# EAGLE design Garage_PCB (EAGLE 6.4)
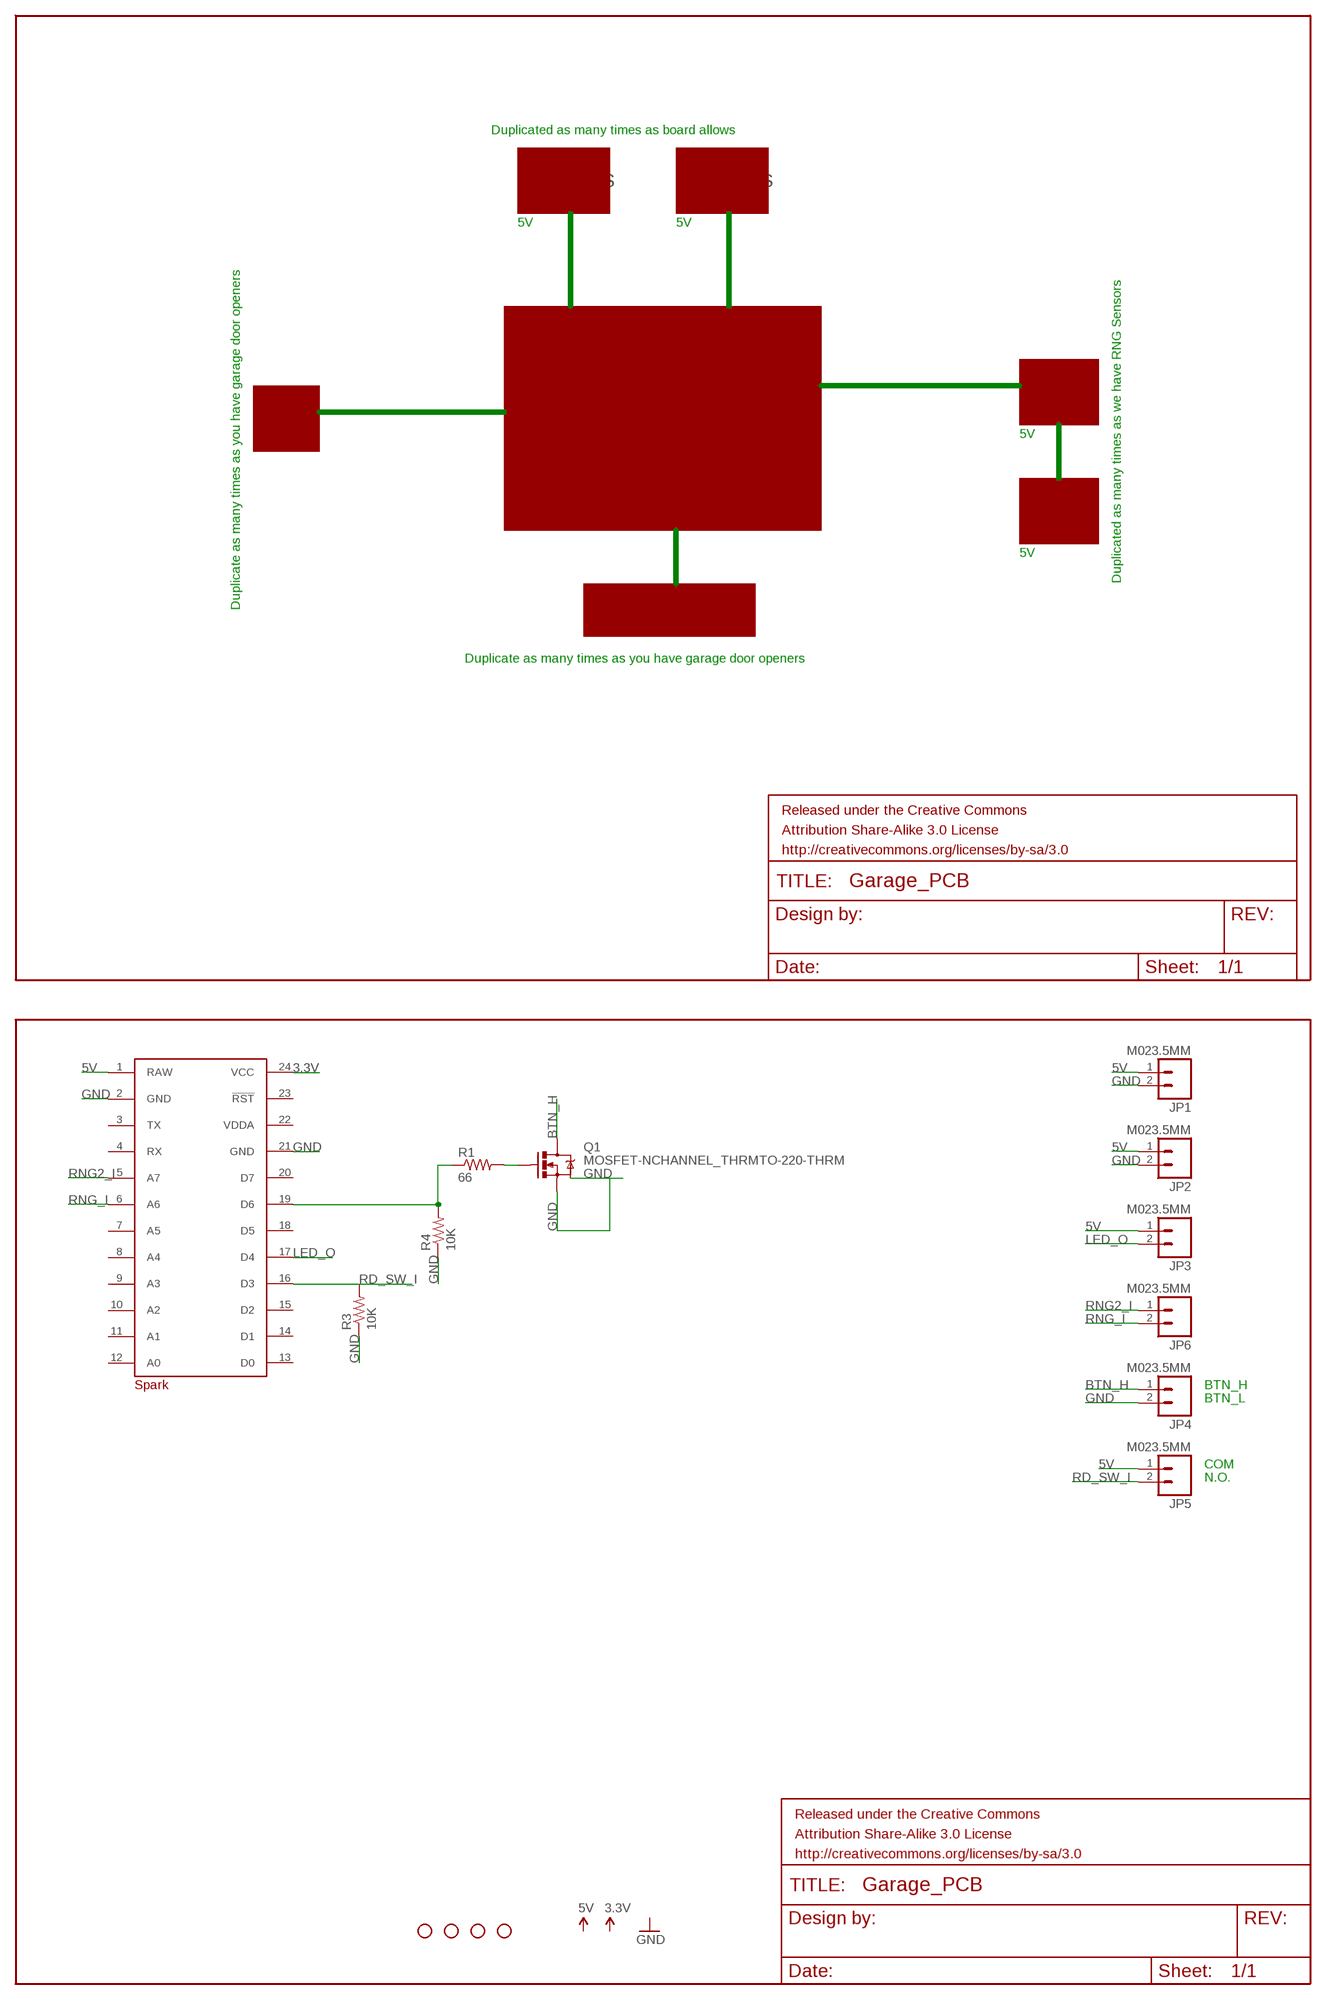
[diagram p0: schematic, sheet 1]

## Parts
FRAME1  FRAME-LETTER  [CREATIVE_COMMONS]
FRAME2  FRAME-LETTER  [CREATIVE_COMMONS]
JP1  M023.5MM  [SCREWTERMINAL-3.5MM-2]
JP2  M023.5MM  [SCREWTERMINAL-3.5MM-2]
JP3  M023.5MM  [SCREWTERMINAL-3.5MM-2]
JP4  M023.5MM  [SCREWTERMINAL-3.5MM-2]
JP5  M023.5MM  [SCREWTERMINAL-3.5MM-2]
JP6  M023.5MM  [SCREWTERMINAL-3.5MM-2]
Q1  MOSFET-NCHANNEL_THRMTO-220-THRM  [TO220-THRM]
R1  66  RESISTOR0603  [0603-RES]
R3  10K  RESISTOR0603  [0603-RES]
R4  10K  RESISTOR0603  [0603-RES]
SPARK  SPARK_CORECORE  [SPARK_CORE]
STANDOFF1  STAND-OFF  [STAND-OFF]
STANDOFF2  STAND-OFF  [STAND-OFF]
STANDOFF3  STAND-OFF  [STAND-OFF]
STANDOFF4  STAND-OFF  [STAND-OFF]
U$2  SPARK_LOGO2  [SPARK_LOGO2]

## Nets
3.3V: SPARK.24(VCC)
5V: JP1.1 JP2.1 JP3.1 JP5.1 SPARK.1(RAW)
BTN_H: JP4.1 Q1.GND(D)
GND: JP1.2 JP2.2 JP4.2 Q1.OUT(S) Q1.THRM R3.1 R4.1 SPARK.2(GND) SPARK.21(GND)
LED_O: JP3.2 SPARK.17(D4)
N$15: R1.1 R4.2 SPARK.19(D6)
N$16: Q1.IN(G) R1.2
RD_SW_I: JP5.2 R3.2 SPARK.16(D3)
RNG2_I: JP6.1 SPARK.5(A7)
RNG_I: JP6.2 SPARK.6(A6)
Unconnected: SPARK.3(TX) SPARK.4(RX) SPARK.7(A5) SPARK.8(A4) SPARK.9(A3) SPARK.10(A2) SPARK.11(A1) SPARK.12(A0) SPARK.13(D0) SPARK.14(D1) SPARK.15(D2) SPARK.18(D5) SPARK.20(D7) SPARK.23(!RST)

## Notes on the sheet
- Duplicated as many times as board allows
- RNG SENS | RNG SENS
- 5V | 5V
- Duplicated as many times as we have RNG Sensors
- LED
- FET | Spark Core
- 5V
- LED
- 5V
- Duplicate as many times as you have garage door openers | REED SW
- Duplicate as many times as you have garage door openers
- BTN_H
- BTN_L
- COM
- N.O.

## Power pins joined to a net without a drawn wire
VDDA: SPARK.22(VDDA)

## Library data of the parts
FRAME1 FRAME2 = SparkFun-Aesthetics:FRAME-LETTER: Schematic Frame Standard 8.5x11 US Letter frame
JP1-JP6 = SparkFun-Connectors:M02: Standard 2-pin 0.1" header. Use with - straight break away headers ( PRT-00116) - right angle break away headers (PRT-00553) - swiss pins (PRT-00743) - machine pins (PRT-00117) - female headers (PRT-00115) Molex polarized connector foot print use with: PRT-08233 with associated crimp pins and housings. 2.54_SCREWTERM for use with PRT-10571. 3.5mm Screw Terminal footprints for PRT-08084 5mm Screw Terminal footprints for use with PRT-08433
Q1 = SparkFun-DiscreteSemi:MOSFET-NCHANNEL_THRM: Common NMOSFET Parts MFG P/N Store ID Prod ID FDD8780 TRANS-09984 SI7820DN TRANS-11055 FDS6630A IC-08089 2N7002PW TRANS-11151 FQP30N06L COM-10213 TRANS-10060 BSS123LT1G TRANS-08345 BSS138 TRANS-00830 BS170 2N7000
R1 R3 R4 = SparkFun-Resistors:RESISTOR: Resistor Basic schematic elements and footprints for 0603, 1206, and PTH resistors.
SPARK = Spark:SPARK_CORE
STANDOFF1-STANDOFF4 = SparkFun-Electromechanical:STAND-OFF: #4 Stand Off This is the mechanical footprint for a #4 phillips button head screw. Use the keepout ring to avoid running the screw head into surrounding components. SKU : PRT-00447
U$2 = Spark:SPARK_LOGO2

## Board
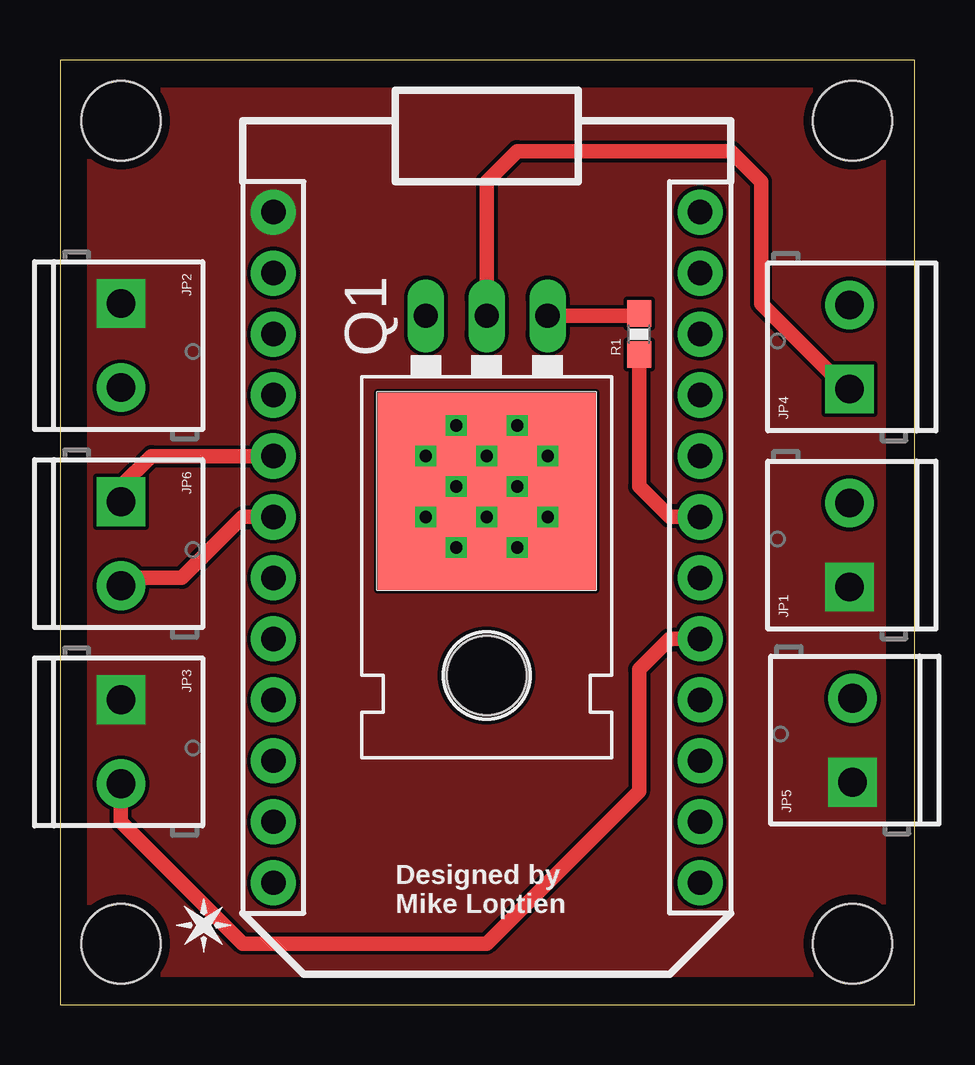
[diagram p1: board, top side]
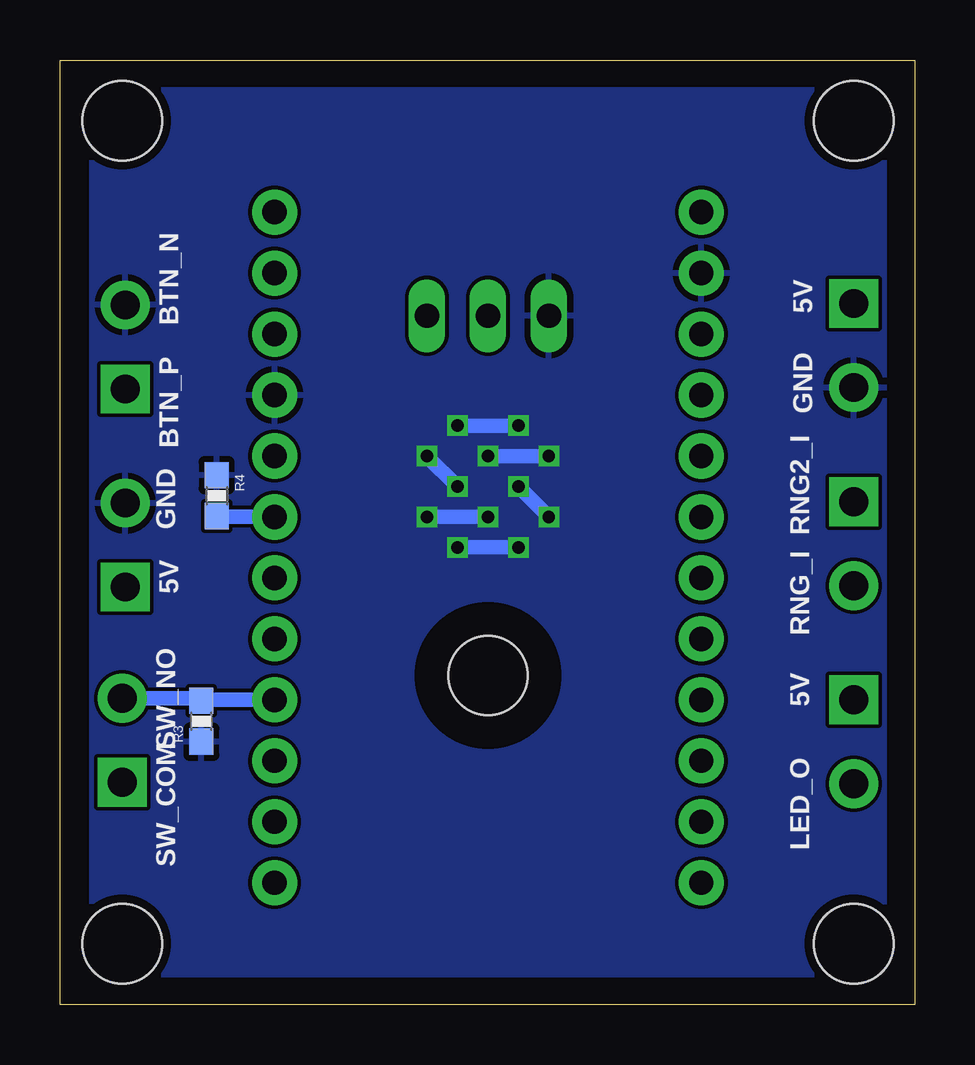
[diagram p2: board, bottom side, seen from below]

Size 35.61 x 39.36 mm. Coordinates in mm from the lower left corner, seen from the top.
Outline: 0,0 35.61,0 35.61,39.36 0,39.36 0,0
Copper layers (1*16): Top 0.0356mm / dielectric 1.5011mm / Bottom 0.0356mm
Design rules "LaenPCBOrder": minimum track width 6mil, minimum drill 13mil, track to track 6mil, track to pad 6mil, pad to pad 6mil, via to via 6mil, smd to smd 6mil, copper to edge 15mil, drill to drill 6mil, minimum pad ring 7mil, minimum via ring 7mil, stop-mask expansion 3mil, vias tented up to drill 0mil, thermal gap 10mil

### Footprints (pad centres in the part's own frame; a part is rotated, then mirrored left to right if it is on the bottom)
SCREWTERMINAL-3.5MM-2 = drill 1.2 pad 2.032 square: 1 0,0 | drill 1.2 pad 2.032: 2 3.5,0
TO220-THRM = drill 1.016 long: GND 0,-6.35; IN -2.54,-6.35; OUT 2.54,-6.35 | smd 9.1 x 8.2: THRM 0,0.96 | hole 3.302: 0,8.636
0603-RES = smd 1.1 x 1: 1 -0.85,0; 2 0.85,0
SPARK_CORE = drill 1.016 pad 1.88: 1 -8.89,13.97; 2 -8.89,11.43; 3 -8.89,8.89; 4 -8.89,6.35; 5 -8.89,3.81; 6 -8.89,1.27; 7 -8.89,-1.27; 8 -8.89,-3.81; 9 -8.89,-6.35; 10 -8.89,-8.89; 11 -8.89,-11.43; 12 -8.89,-13.97; 13 8.89,-13.97; 14 8.89,-11.43; 15 8.89,-8.89; 16 8.89,-6.35; 17 8.89,-3.81; 18 8.89,-1.27; 19 8.89,1.27; 20 8.89,3.81; 21 8.89,6.35; 22 8.89,8.89; 23 8.89,11.43; 24 8.89,13.97
STAND-OFF = hole 3.302: 0,0

### Placement (x,y rotation side)
FRAME1  -77.47,49.53 0 top  (outside the outline)
FRAME2  -77.47,-12.7 0 top  (outside the outline)
JP1  32.89,17.4 90 top
JP2  2.54,29.21 270 top
JP3  2.54,12.7 270 top
JP4  32.89,25.65 90 top
JP5  33.02,9.27 90 top
JP6  2.54,20.95 270 top
Q1  17.78,22.35 180 top
R1  24.13,27.94 90 top
R3  29.72,11.81 90 bottom
R4  29.08,21.21 270 bottom
SPARK  17.78,19.05 0 top
STANDOFF1  2.54,2.54 0 top
STANDOFF2  33.02,2.54 0 top
STANDOFF3  2.54,36.83 0 top
STANDOFF4  33.02,36.83 0 top
U$2  4.83,4.45 270 top

### Tracks (layer width: path | path; a pad name or v marks a point on that pad's centre or on a via)
5V
  pour Top (no thermals): 1.27,38.1 34.29,38.1 34.29,1.27 1.27,1.27
BTN_H
  Top 0.61: JP4.1 32.77,25.65 29.21,29.21 29.21,34.29 27.94,35.56 19.05,35.56 17.78,34.29 Q1.GND
GND  (via drill 0.51)
  Top 0.61: Q1.THRM v17.78,22.86 | v15.24,22.86 v16.51,24.13 | v19.05,24.13 v20.32,22.86 | v19.05,21.59 v16.51,21.59 | v15.24,20.32 v17.78,20.32 | v20.32,20.32 v19.05,19.05 | v16.51,19.05 15.24,17.78
  Bottom 0.61: v17.78,22.86 v15.24,22.86 | v16.51,24.13 v19.05,24.13 | v20.32,22.86 v19.05,21.59 | v16.51,21.59 v15.24,20.32 | v17.78,20.32 v20.32,20.32 | v19.05,19.05 v16.51,19.05
  pour Bottom: 1.27,38.1 34.29,38.1 34.29,1.27 1.27,1.27
LED_O
  Top 0.61: SPARK.17 25.4,15.24 24.13,13.97 24.13,8.89 17.78,2.54 7.62,2.54 2.54,7.62 JP3.2
N$15
  Top 0.61: R1.1 24.13,21.59 25.4,20.32 SPARK.19
  Bottom 0.61: SPARK.19 29.04,20.32 R4.2
N$16
  Top 0.61: Q1.IN 24.04,28.7 R1.2
RD_SW_I
  Bottom 0.61: SPARK.16 29.68,12.7 R3.2 29.83,12.77 JP5.2
RNG2_I
  Top 0.61: JP6.1 2.54,21.59 3.81,22.86 SPARK.5
RNG_I
  Top 0.61: SPARK.6 7.62,20.32 5.08,17.78 2.87,17.78 JP6.2

### Text on the board
tPlace: Designed by / Mike Loptien
bPlace: BTN_N | 5V | GND | BTN_P | RNG2_I | GND | RNG_I | 5V | SW_NO | 5V | SW_COM | LED_O